# Altium schematic sheet DDS.SchDoc
size A4; SheetNumber: 5; SheetTotal: 6
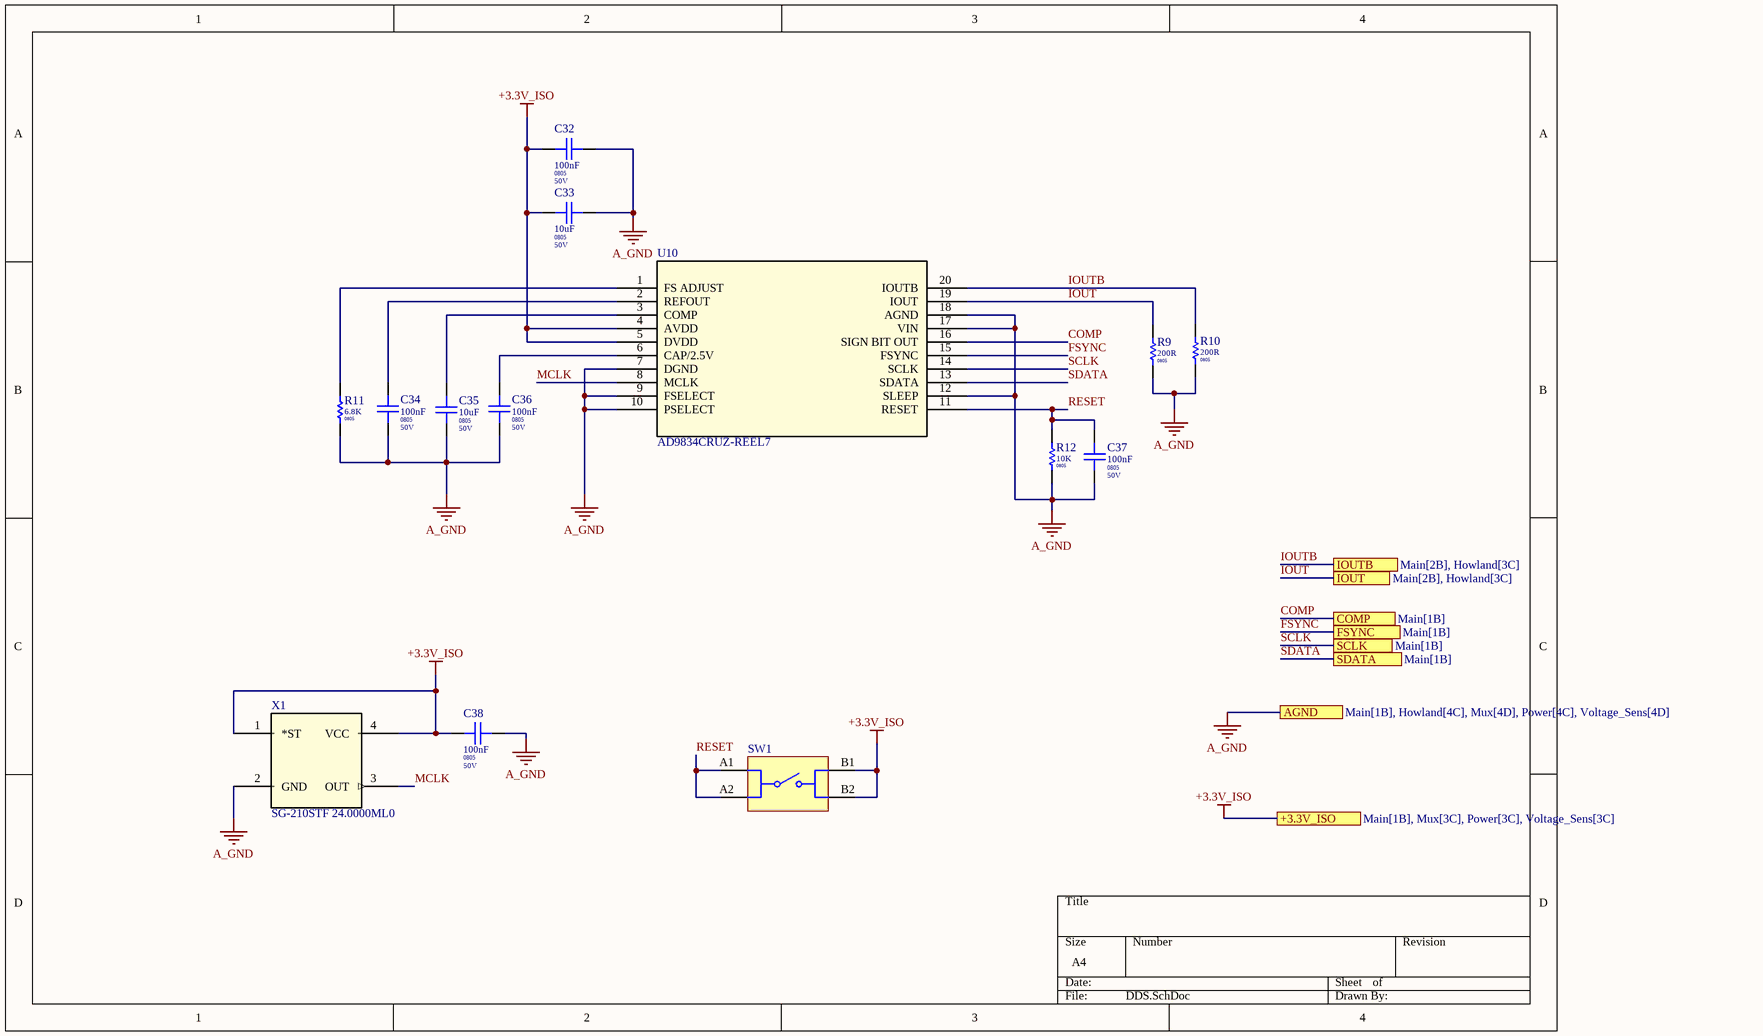
[diagram p0: DDS.SchDoc]

## Parts
C32  Package / Case: 0805  Voltage: 50V  [CAPC 0805]  (hidden comment: 100nF)
C33  Package / Case: 0805  Voltage: 50V  [CAPC 0805]  (hidden comment: 10uF)
C34  Package / Case: 0805  Voltage: 50V  [CAPC 0805]  (hidden comment: 100nF)
C35  Package / Case: 0805  Voltage: 50V  [CAPC 0805]  (hidden comment: 10uF)
C36  Package / Case: 0805  Voltage: 50V  [CAPC 0805]  (hidden comment: 100nF)
C37  Package / Case: 0805  Voltage: 50V  [CAPC 0805]  (hidden comment: 100nF)
C38  Package / Case: 0805  Voltage: 50V  [CAPC 0805]  (hidden comment: 100nF)
R9  Package / Case: 0805  [RESC 0805]  (hidden comment: 200R)
R10  Package / Case: 0805  [RESC 0805]  (hidden comment: 200R)
R11  Package / Case: 0805  [RESC 0805]  (hidden comment: 6.8K)
R12  Package / Case: 0805  [RESC 0805]  (hidden comment: 10K)
SW1  430451025836  [430451025836]  (value not drawn)
U10  AD9834CRUZ-REEL7  [RU_20_ADI-M]
X1  SG-210STF 24.0000ML0  [SG-210STF_EPS]

## Ports
+3.3V_ISO (see Main[1B], Mux[3C], Power[3C], Voltage_Sens[3C]), AGND (see Main[1B], Howland[4C], Mux[4D], Power[4C], Voltage_Sens[4D]), COMP (see Main[1B]), FSYNC (see Main[1B]), IOUT (see Main[2B], Howland[3C]), IOUTB (see Main[2B], Howland[3C]), SCLK (see Main[1B]), SDATA (see Main[1B])

## Nets
+3.3V_ISO: C32.2 C33.2 C38.2 SW1.B1 SW1.B2 U10.4(AVDD) U10.5(DVDD) X1.1(*ST) X1.4(VCC) ; port +3.3V_ISO
A_GND: C32.1 C33.1 C34.2 C35.2 C36.2 C37.2 C38.1 R9.1 R10.1 R11.1 R12.1 U10.7(DGND) U10.9(FSELECT) U10.10(PSELECT) U10.12(SLEEP) U10.17(VIN) U10.18(AGND) X1.2(GND) ; port AGND
COMP: U10.16(SIGN_BIT_OUT) ; port COMP
FSYNC: U10.15(FSYNC) ; port FSYNC
IOUT: R9.2 U10.19(IOUT) ; port IOUT
IOUTB: R10.2 U10.20(IOUTB) ; port IOUTB
MCLK: U10.8(MCLK) X1.3(OUT)
RESET: C37.1 R12.2 SW1.A1 SW1.A2 U10.11(RESET)
SCLK: U10.14(SCLK) ; port SCLK
SDATA: U10.13(SDATA) ; port SDATA
NetC34_1: C34.1 U10.2(REFOUT)
NetC35_1: C35.1 U10.3(COMP)
NetC36_1: C36.1 U10.6(CAP/2.5V)
NetR11_2: R11.2 U10.1(FS_ADJUST)

## Library data of the parts
C32 C34 C36-C38 = CAPC0572: Capacitor Ceramic 100nF 50V 0805; Tolerance: %10; Value Rating: nF; Favorites: Favorite; Value: 100nF; Part Number: CAPC0572; Category: Capacitor Ceramic; Values: 100nF 50V
C33 C35 = CAPC0588: Capacitor Ceramic 10uF 50V 0805; Tolerance: %10; Value Rating: uF; Value: 10uF; Part Number: CAPC0588; Category: Capacitor Ceramic; Values: 10uF 50V
R9 R10 = R0325: 200R 0805; Part Number: R0325; Tolerance: %5; Power: 1/10W; Value: 200R; Category: Resistor; Values: 200R
R11 = R0362: 6.8K 0805; Part Number: R0362; Tolerance: %5; Power: 1/10W; Value: 6.8K; Category: Resistor; Values: 6.8K
R12 = R0366: 10K 0805; Part Number: R0366; Tolerance: %5; Power: 1/10W; Value: 10K; Category: Resistor; Values: 10K
SW1 = 430451025836: WS-TASV SMT Washable Tact Switch, 6mm x 6mm x 2.5mm, SPST-NO, 360gf, 12V, 50mA; Manufacturer: Wurth Elektronik; Washable: Yes; Manufacturer Part Number: 430451025836; Category: Tact Switch; Match Code: WS-TASV; ComponentLink1Description: Website Link; ComponentLink1URL: https://www.we-online.com/redexpert/article/430451025836?ad; ComponentLink2Description: Datasheet Link; ComponentLink2URL: https://www.we-online.com/redexpert/spec/430451025836?ad; Mount: Surface Mount; Min Operating Temperature: -40°C; Max Operating Temperature: 85°C; Packaging: Tape and Reel; Length: 6mm; Width: 6mm; Height: 2.5mm; Circuit: SPST-NO; Contact Material: Stainless Steel; Contact Plating: Silver; Operation Force: 360gf; Rated Current: 50mA; Rated Voltage (DC): 12V; Terminal Material: Brass; Terminal Plating: Silver
U10 = AD9834CRUZ-REEL7: 20 mW Power, 2.3 V to 5.5 V, 75 MHz Complete DDS; Manufacturer_Name: Analog Devices Inc; Copyright: Copyright (C) 2026 Ultra Librarian. All rights reserved.; Manufacturer_Part_Number: AD9834CRUZ-REEL7; RefDes: RefDes; Type: Type
X1 = SG-210STF 24.0000ML0: Description; Manufacturer_Name: Epson; Type: Oscillators; Copyright: Copyright (C) 2025 Ultra Librarian. All rights reserved.; Manufacturer_Part_Number: SG-210STF 24.0000ML0; RefDes: RefDes